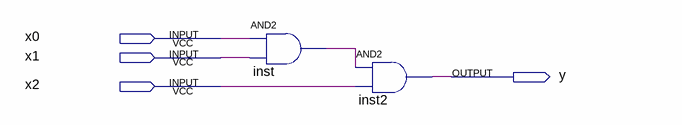
[diagram p0: schematic sheet]
// Quartus schematic and_3.bdf as structural Verilog: 2 symbols, 4 pins
module and_3 (
  input  x0,
  input  x1,
  input  x2,
  output y
);

  wire inst_out;

  and inst (inst_out, x0, x1);
  and inst2 (y, inst_out, x2);
endmodule
